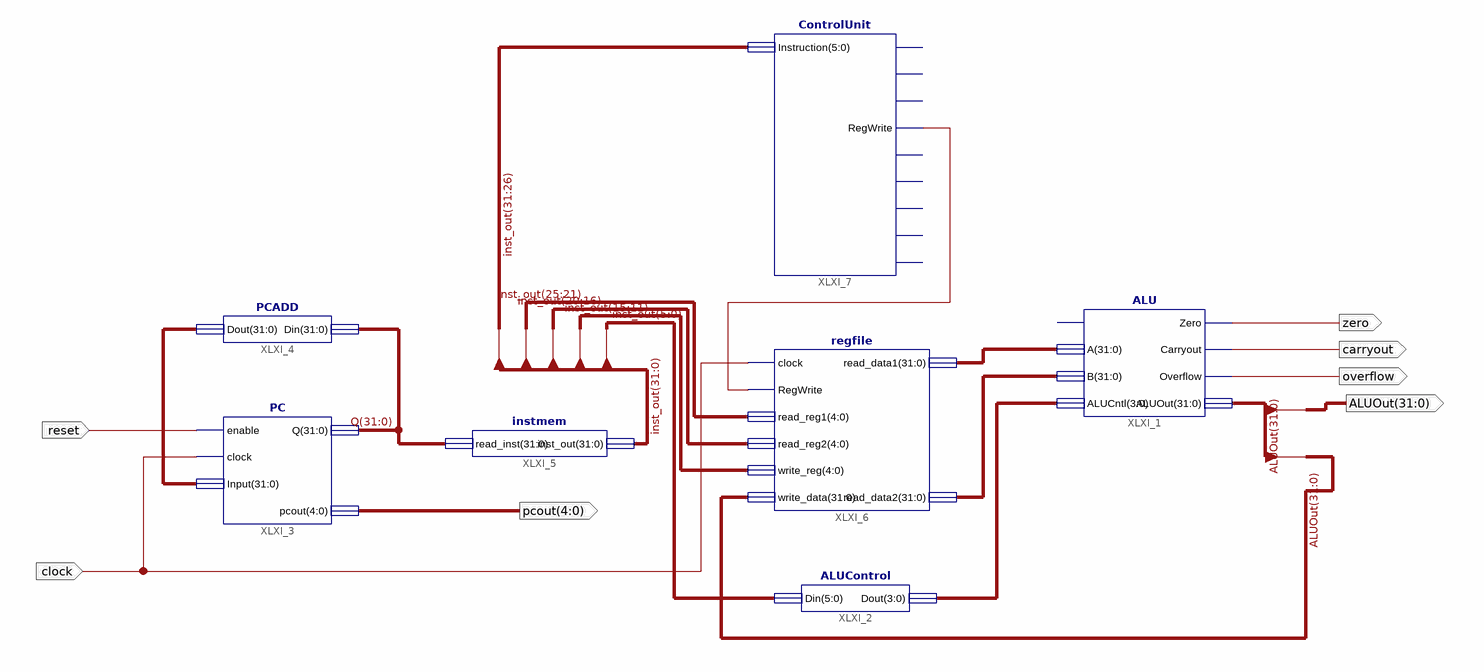
[diagram p0: schematic sheet 1]
// Xilinx ISE schematic NewDataPath.sch (spartan3e) as structural Verilog: 7 symbols, 7 ports
module NewDataPath (
  input  reset,
  input  clock,
  output [4:0] pcout,
  output overflow,
  output carryout,
  output zero,
  output [31:0] ALUOut
);

  wire XLXN_37;
  wire [3:0] XLXN_40;
  wire [31:0] inst_out, Q, XLXN_29, XLXN_38, XLXN_39;

  ALU XLXI_1 (
    .A(XLXN_38), .B(XLXN_39), .ALUCntl(XLXN_40), .Zero(zero), .Carryout(carryout), .Overflow(overflow),
    .ALUOut(ALUOut));  // open: Carryin
  ALUControl XLXI_2 (.Din(inst_out[5:0]), .Dout(XLXN_40));
  PC XLXI_3 (.enable(reset), .clock(clock), .Input(XLXN_29), .Q(Q), .pcout(pcout));
  PCADD XLXI_4 (.Din(Q), .Dout(XLXN_29));
  instmem XLXI_5 (.read_inst(Q), .inst_out(inst_out));
  regfile XLXI_6 (
    .clock(clock), .RegWrite(XLXN_37), .read_reg1(inst_out[25:21]), .read_reg2(inst_out[20:16]),
    .write_reg(inst_out[15:11]), .write_data(ALUOut), .read_data1(XLXN_38), .read_data2(XLXN_39));
  ControlUnit XLXI_7 (
    .Instruction(inst_out[31:26]), .RegWrite(XLXN_37));  // open: RegDst, ALUSrc, MemtoReg, MemRead, MemWrite, Branch, ALUop1, ALUop0
endmodule
